# EAGLE schematic dpMaster (EAGLE 7.5.0)
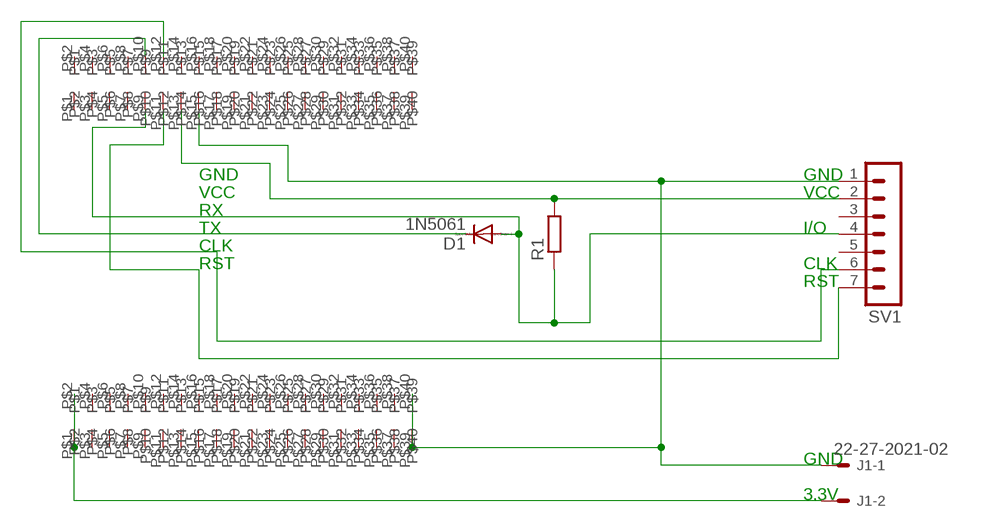
[diagram p0: schematic, sheet 1]

## Parts
D1  1N5061  [SOD57-10]
J1  22-27-2021-02  [6410-02]
R1  R-EU_0207/12  [0207/12]
SV1  MA07-1  [MA07-1]
U$1  SFC-120-T2-L-D  [SFC-120-T2-L-D]
U$2  SFC-120-T2-L-D  [SFC-120-T2-L-D]

## Nets
N$2: D1.C U$1.P$10
N$4: SV1.6 U$1.P$12
N$6: J1.2 U$2.P$1 U$2.P$2
N$8: D1.A R1.1 SV1.4 U$1.P$9
N$9: SV1.7 U$1.P$11
N$12: R1.2 SV1.2 U$1.P$13
N$14: J1.1 SV1.1 U$1.P$15 U$2.P$39 U$2.P$40
Unconnected: SV1.3 SV1.5 U$1.P$1 U$1.P$2 U$1.P$3 U$1.P$4 U$1.P$5 U$1.P$6 U$1.P$7 U$1.P$8 U$1.P$14 U$1.P$16 U$1.P$17 U$1.P$18 U$1.P$19 U$1.P$20 U$1.P$21 U$1.P$22 U$1.P$23 U$1.P$24 U$1.P$25 U$1.P$26 U$1.P$27 U$1.P$28 U$1.P$29 U$1.P$30 U$1.P$31 U$1.P$32 U$1.P$33 U$1.P$34 U$1.P$35 U$1.P$36 U$1.P$37 U$1.P$38 U$1.P$39 U$1.P$40 U$2.P$3 U$2.P$4 U$2.P$5 U$2.P$6 U$2.P$7 U$2.P$8 U$2.P$9 U$2.P$10 U$2.P$11 U$2.P$12 U$2.P$13 U$2.P$14 U$2.P$15 U$2.P$16 U$2.P$17 U$2.P$18 U$2.P$19 U$2.P$20 U$2.P$21 U$2.P$22 U$2.P$23 U$2.P$24 U$2.P$25 U$2.P$26 U$2.P$27 U$2.P$28 U$2.P$29 U$2.P$30 U$2.P$31 U$2.P$32 U$2.P$33 U$2.P$34 U$2.P$35 U$2.P$36 U$2.P$37 U$2.P$38

## Notes on the sheet
- GND | GND
- VCC | VCC
- RX
- TX | I/O
- CLK
- RST | CLK
- RST
- GND
- 3.3V

## Library data of the parts
D1 = diode:1N5061: DIODE controlled avalanche rectifier
J1 = con-molex:22-?-02: CONNECTOR wire to board 2.54 mm (.1 inch) pitch header; OC_FARNELL: unknown; OC_NEWARK: unknown
R1 = rcl:R-EU_: RESISTOR, European symbol
SV1 = con-lstb:MA07-1: PIN HEADER; OC_FARNELL: unknown; OC_NEWARK: unknown
U$1 U$2 = sfc-120-t2-l-d:SFC-120-T2-L-D